# Altium schematic sheet 26PinSuperseal.SchDoc
size A
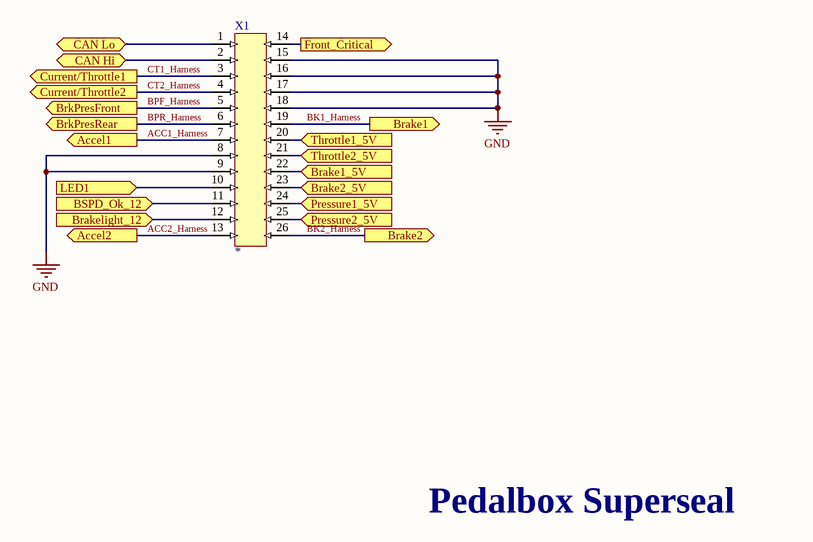
[diagram p0: 26PinSuperseal.SchDoc]

## Parts
X1  *  [SUPERSEAL 26POS 90Deg]

## Ports
Accel1 (out), Accel2 (out), Brake1 (out), Brake1_5V (in), Brake2 (out), Brake2_5V (in), Brakelight_12 (in), BrkPresFront (out), BrkPresRear (out), BSPD_Ok_12 (in), CAN Hi (bidir), CAN Lo (bidir), Current/Throttle1 (out), Current/Throttle2 (out), Front_Critical (out), LED1 (in), Pressure1_5V (in), Pressure2_5V (in), Throttle1_5V (in), Throttle2_5V (in)

## Nets
GND: X1.8 X1.9 X1.15 X1.16 X1.17 X1.18
ACC1_Harness: X1.7 ; port Accel1
ACC2_Harness: X1.13 ; port Accel2
BK1_Harness: X1.19 ; port Brake1
BK2_Harness: X1.26 ; port Brake2
BPF_Harness: X1.5 ; port BrkPresFront
BPR_Harness: X1.6 ; port BrkPresRear
Brake1_5V: X1.22 ; port Brake1_5V
Brake2_5V: X1.23 ; port Brake2_5V
Brakelight_12: X1.12 ; port Brakelight_12
BSPD_Ok_12: X1.11 ; port BSPD_Ok_12
CAN Hi: X1.2 ; port CAN Hi
CAN Lo: X1.1 ; port CAN Lo
CT1_Harness: X1.3 ; port Current/Throttle1
CT2_Harness: X1.4 ; port Current/Throttle2
Front_Critical: X1.14 ; port Front_Critical
LED1: X1.10 ; port LED1
Pressure1_5V: X1.24 ; port Pressure1_5V
Pressure2_5V: X1.25 ; port Pressure2_5V
Throttle1_5V: X1.20 ; port Throttle1_5V
Throttle2_5V: X1.21 ; port Throttle2_5V

## Notes on the sheet
- Pedalbox Superseal

## Library data of the parts
X1 = 21: AMP Superseal 90Deg; id: 21; name: 6437288-4; numcontacts: 26; numrows: 4; pitch: 3mm; MfrPartNo: *; quantity: 0; link: https://www.te.com/usa-en/product-6437288-4.html#guest-click